# Altium schematic sheet Valve.SchDoc: ZStation Valve
size A4; Engineer: Stephan Eersels; DocumentNumber: 12202925_ZS; Revision: 2.1; SheetNumber: 8; SheetTotal: 8